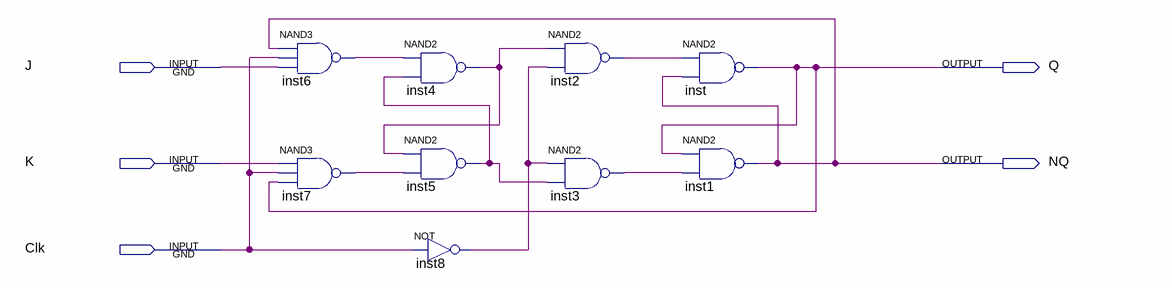
[diagram p0: schematic sheet]
// Quartus schematic JK_flip_flop_master_slave.bdf as structural Verilog: 9 symbols, 5 pins
module JK_flip_flop_master_slave (
  input  J,
  input  K,
  input  Clk,
  output Q,
  output NQ
);

  wire inst2_out, inst3_out, inst4_out, inst5_out, inst6_out, inst7_out, inst8_out;

  nand inst6 (inst6_out, NQ, Clk, J);
  nand inst7 (inst7_out, K, Clk, Q);
  nand inst4 (inst4_out, inst6_out, inst5_out);
  nand inst5 (inst5_out, inst4_out, inst7_out);
  not inst8 (inst8_out, Clk);
  nand inst2 (inst2_out, inst4_out, inst8_out);
  nand inst3 (inst3_out, inst8_out, inst5_out);
  nand inst (Q, inst2_out, NQ);
  nand inst1 (NQ, Q, inst3_out);
endmodule
